# Altium schematic sheet STPMXX.SchDoc
size A3
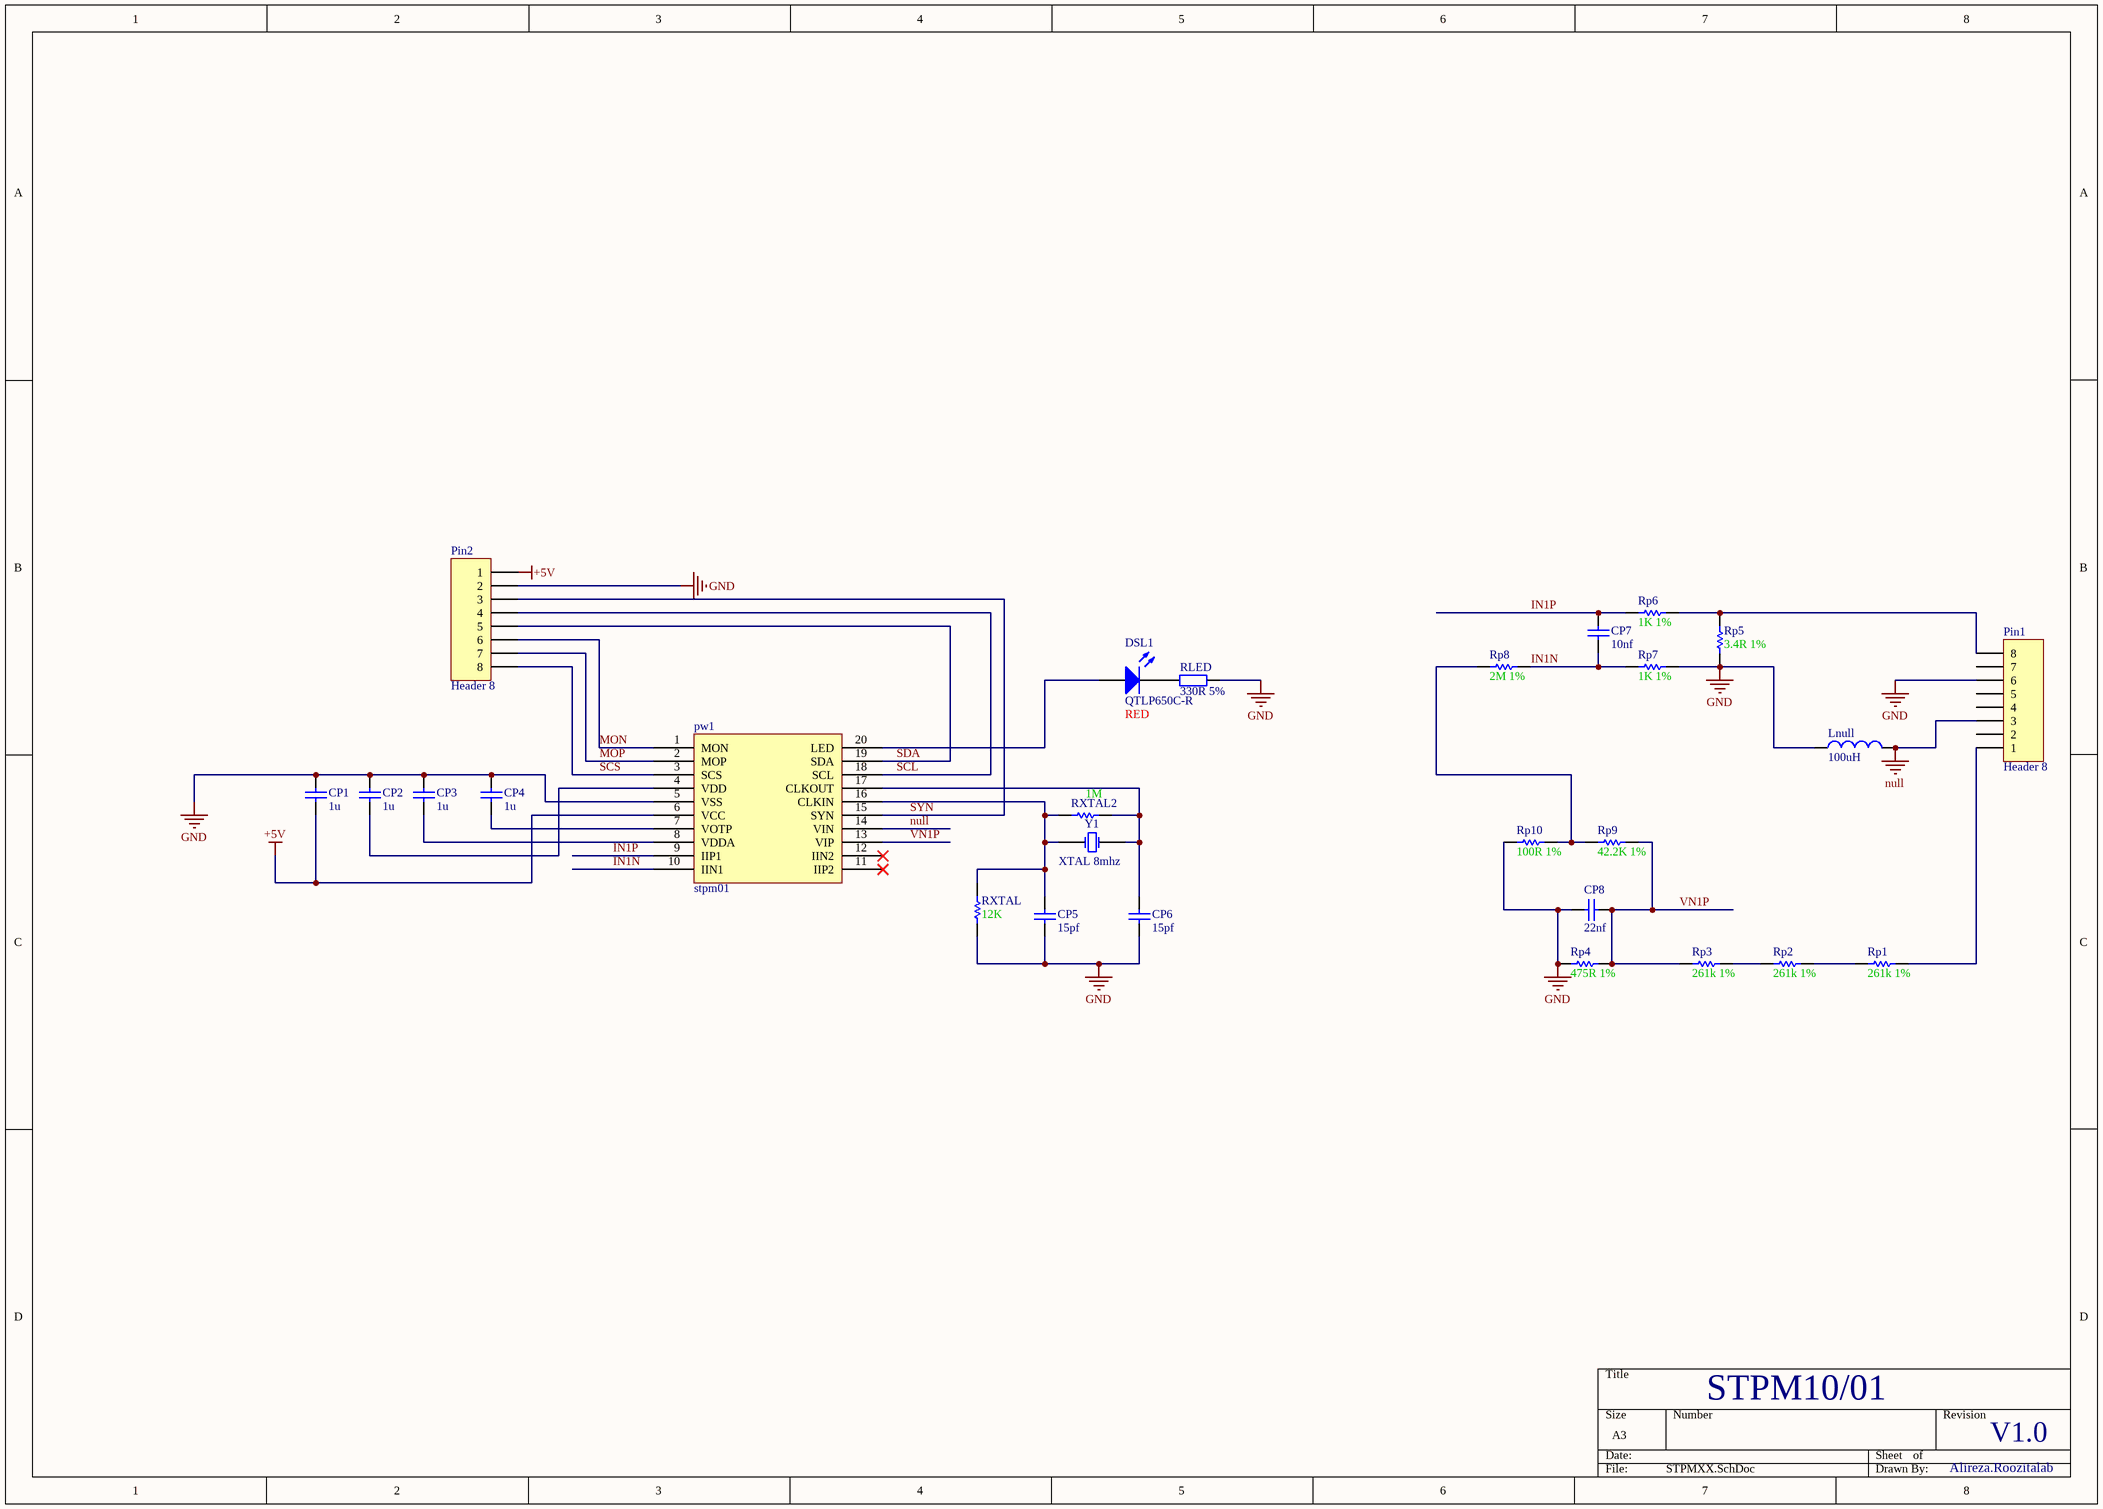
[diagram p0: STPMXX.SchDoc]

## Parts
CP1  value 1u  [CAP 1206 (3216X08L)]  (hidden comment: Cap)
CP2  value 1u  [CAP 1206 (3216X08L)]  (hidden comment: Cap)
CP3  value 1u  [CAP 1206 (3216X08L)]  (hidden comment: Cap)
CP4  value 1u  [CAP 1206 (3216X08L)]  (hidden comment: Cap)
CP5  value 15pf  [CAP 1206 (3216X08L)]  (hidden comment: Cap)
CP6  value 15pf  [CAP 1206 (3216X08L)]  (hidden comment: Cap)
CP7  value 10nf  [CAP 1206 (3216X08L)]  (hidden comment: Cap)
CP8  value 22nf  [CAP 1206 (3216X08L)]  (hidden comment: Cap)
DSL1  QTLP650C-R  value RED  [led-1206]
Lnull  value 100uH  [INDUCTOR-1206]  (hidden comment: Inductor)
Pin1  Header 8  [HDR1X8]
Pin2  Header 8  [HDR1X8]
pw1  stpm01  [TSSOP]
RLED  value 330R 5%  [RES 1206 (3216X08L)]  (hidden comment: Res2)
Rp1  value 261k 1%  [RES 1206 (3216X08L)]  (hidden comment: Res Semi)
Rp2  value 261k 1%  [RES 1206 (3216X08L)]  (hidden comment: Res Semi)
Rp3  value 261k 1%  [RES 1206 (3216X08L)]  (hidden comment: Res Semi)
Rp4  value 475R 1%  [RES 1206 (3216X08L)]  (hidden comment: Res Semi)
Rp5  value 3.4R 1%  [RES 1206 (3216X08L)]  (hidden comment: Res Semi)
Rp6  value 1K 1%  [RES 1206 (3216X08L)]  (hidden comment: Res Semi)
Rp7  value 1K 1%  [RES 1206 (3216X08L)]  (hidden comment: Res Semi)
Rp8  value 2M 1%  [RES 1206 (3216X08L)]  (hidden comment: Res Semi)
Rp9  value 42.2K 1%  [RES 1206 (3216X08L)]  (hidden comment: Res Semi)
Rp10  value 100R 1%  [RES 1206 (3216X08L)]  (hidden comment: Res Semi)
RXTAL  value 12K  [RES 1206 (3216X08L)]  (hidden comment: Res Semi)
RXTAL2  value 1M  [RES 1206 (3216X08L)]  (hidden comment: Res Semi)
Y1  XTAL 8mhz  [XTAL SMALL]

## Nets
+5V: CP1.1 Pin2.1 pw1.6(VCC)
GND: CP1.2 CP2.2 CP3.2 CP4.2 CP5.1 CP6.1 CP8.2 Lnull.1 Pin1.6 Pin2.2 pw1.5(VSS) RLED.1 Rp4.2 Rp5.1 Rp7.2 Rp10.1 RXTAL.1
null: Lnull.2 Pin1.3 pw1.14(VIN)
IN1N: CP7.1 pw1.10(IIN1) Rp7.1 Rp8.2
IN1P: CP7.2 pw1.9(IIP1) Rp6.1
MON: Pin2.6 pw1.1(MON)
MOP: Pin2.7 pw1.2(MOP)
SCL: Pin2.4 pw1.18(SCL)
SCS: Pin2.8 pw1.3(SCS)
SDA: Pin2.5 pw1.19(SDA)
SYN: Pin2.3 pw1.15(SYN)
VN1P: CP8.1 pw1.13(VIP) Rp3.2 Rp4.1 Rp9.2
NetCP2_1: CP2.1 pw1.4(VDD)
NetCP3_1: CP3.1 pw1.8(VDDA)
NetCP4_1: CP4.1 pw1.7(VOTP)
NetCP5_2: CP5.2 pw1.16(CLKIN) RXTAL.2 RXTAL2.2 Y1.1(OSC1)
NetCP6_2: CP6.2 pw1.17(CLKOUT) RXTAL2.1 Y1.2(OSC2)
NetDSL1_1: DSL1.1(A) pw1.20(LED)
NetDSL1_2: DSL1.2(K) RLED.2
NetPin1_1: Pin1.1 Rp1.1
NetPin1_8: Pin1.8 Rp5.2 Rp6.2
NetRp1_2: Rp1.2 Rp2.1
NetRp2_2: Rp2.2 Rp3.1
NetRp8_1: Rp8.1 Rp9.1 Rp10.2

Not connected (* = marked no-connect by the designer): Pin1 2 4 5 7; pw1 11(IIP2)* 12(IIN2)*

## Notes on the sheet
- STPM10/01
- V1.0
- Alireza.Roozitalab

## Library data of the parts
CP1-CP8 = Cap: Capacitor; Published: 8-Jun-2000; LatestRevisionDate: 17-Jul-2002; LatestRevisionNote: Re-released for DXP Platform.; PackageReference: RAD-0.3; Publisher: Altium Limited
DSL1 = LED0_1: Typical INFRARED GaAs LED; Published: 8-Jun-2000; LatestRevisionDate: 08-Jul-2005; LatestRevisionNote: Mech Layer 1 removed.; PackageReference: LED-0; Publisher: Altium Limited
Lnull = Inductor_1: Code_IEC: 1005; Published: 8-Jun-2000; LatestRevisionDate: 17-Jul-2002; LatestRevisionNote: Re-released for DXP Platform.; PackageReference: 0402-A; Publisher: Altium Limited; Code_JEITA: 0402
Pin1 Pin2 = Header 8: Header, 8-Pin; LatestRevisionDate: 17-Jul-2002; LatestRevisionNote: Re-released for DXP Platform.; Publisher: Altium Limited
RLED = Res2_1: Resistor; Published: 8-Jun-2000; LatestRevisionDate: 17-Jul-2002; LatestRevisionNote: Re-released for DXP Platform.; PackageReference: AXIAL-0.4; Publisher: Altium Limited
Rp1-Rp10 RXTAL RXTAL2 = Res Semi: Semiconductor Resistor; Published: 8-Jun-2000; LatestRevisionDate: 17-Jul-2002; LatestRevisionNote: Re-released for DXP Platform.; PackageReference: AXIAL-0.5; Publisher: Altium Limited
Y1 = XTAL: Crystal Oscillator; Published: 8-Jun-2000; LatestRevisionDate: 17-Jul-2002; LatestRevisionNote: Re-released for DXP Platform.; PackageReference: R38; Publisher: Altium Limited